# EAGLE design untitled (EAGLE 9.6.2)
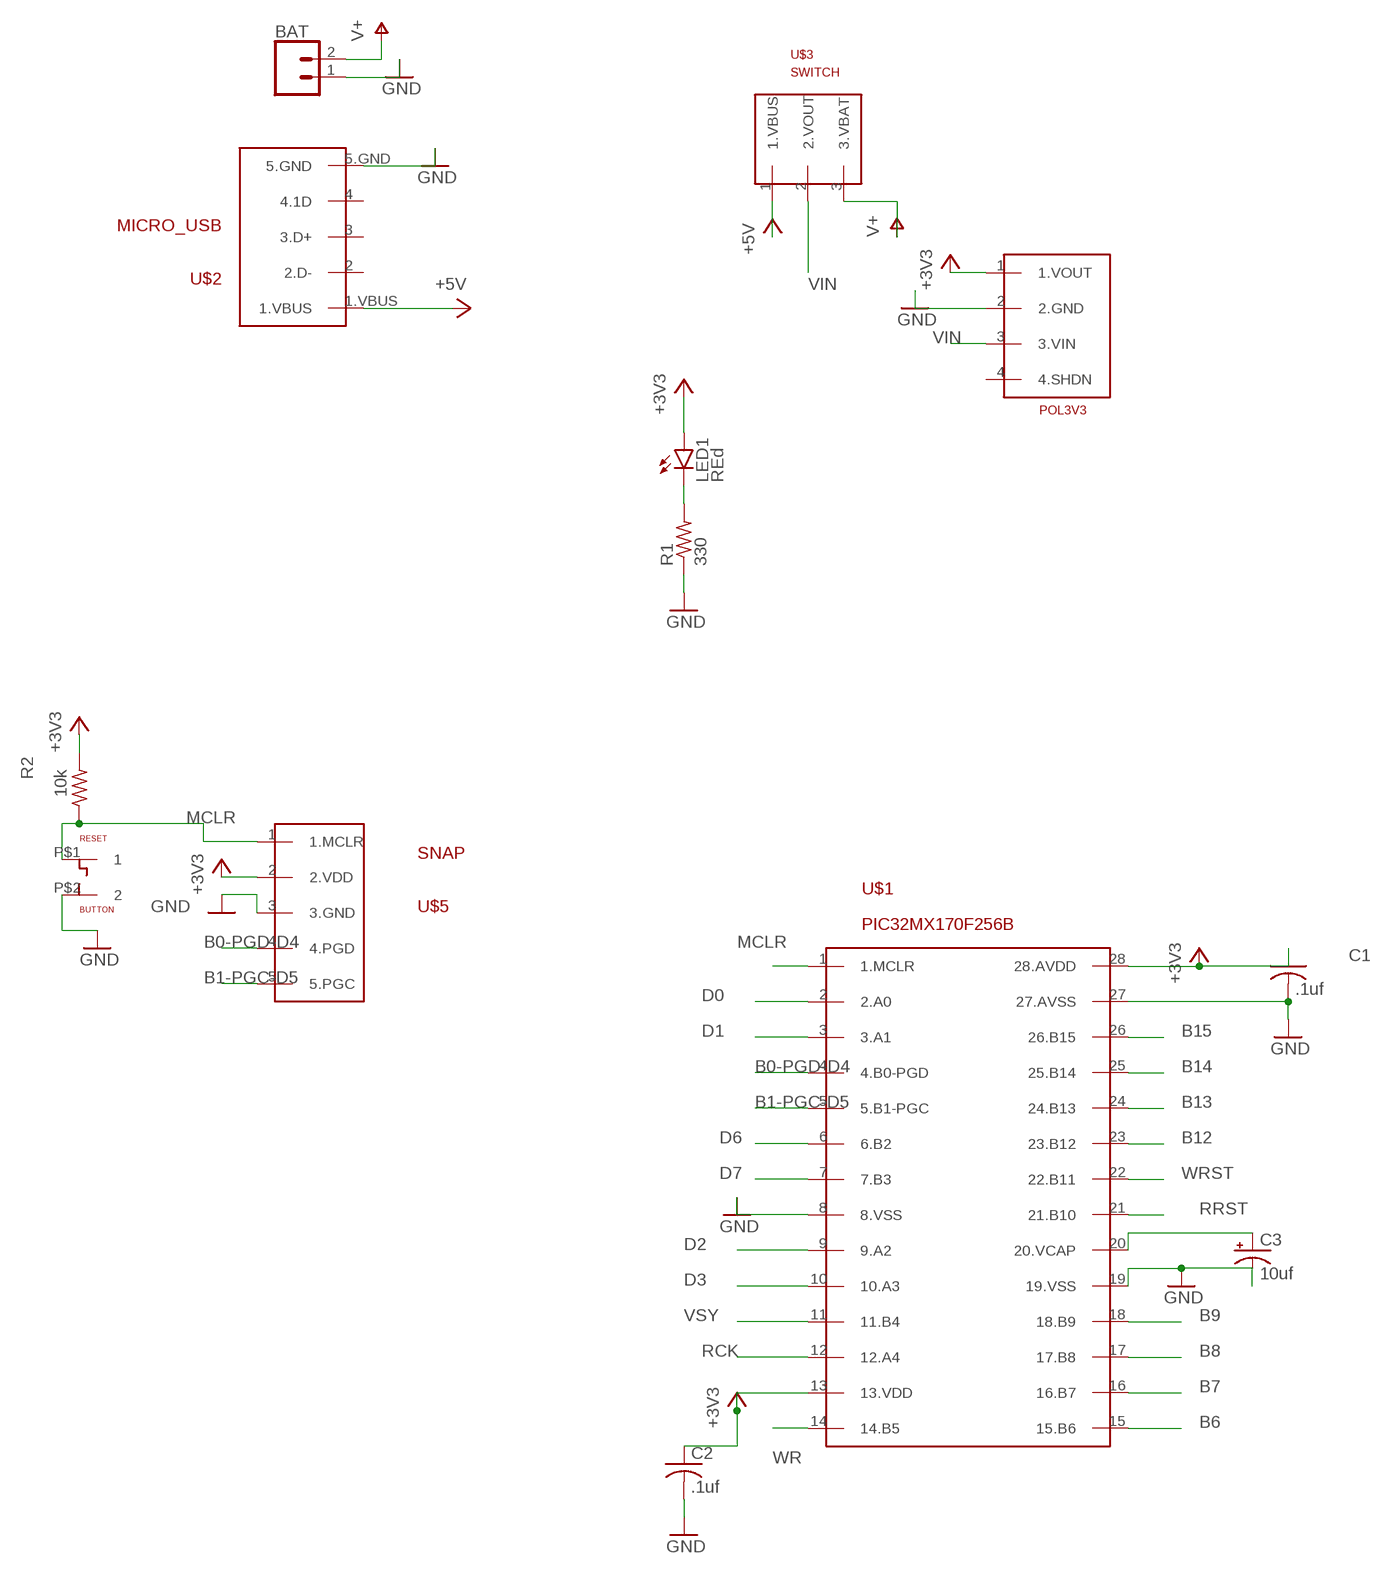
[diagram p0: schematic, sheet 1, part 1 of 2]
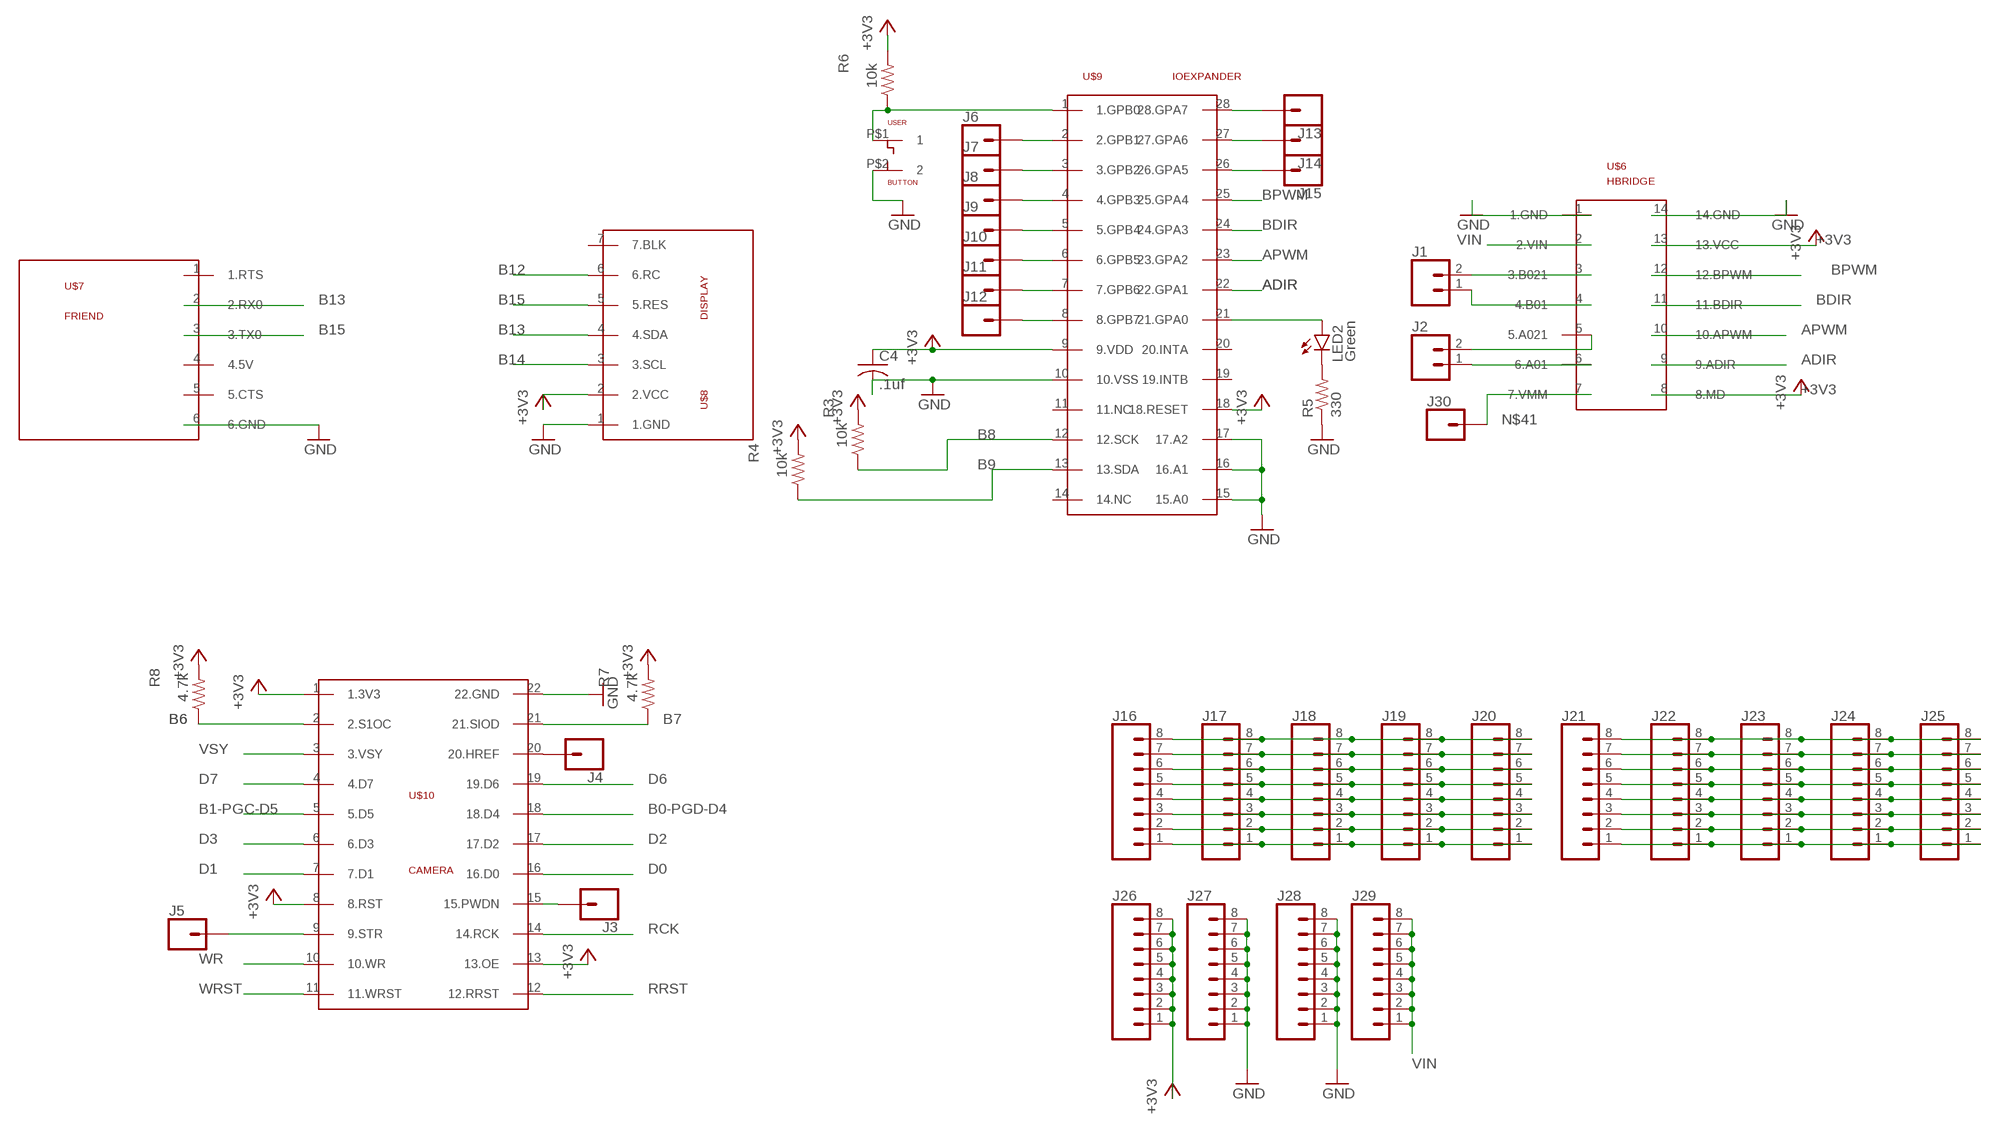
[diagram p1: schematic, sheet 1, part 2 of 2]

## Parts
BAT  CONN_02  [1X02]
C1  .1uf  C-US025-030X050  [C025-030X050]
C2  .1uf  C-US025-030X050  [C025-030X050]
C3  10uf  CPOL-USB45181B  [B45181B]
C4  .1uf  C-US025-030X050  [C025-030X050]
J1  CONN_02  [1X02]
J2  CONN_02  [1X02]
J3  CONN_01  [1X01]
J4  CONN_01  [1X01]
J5  CONN_01  [1X01]
J6  CONN_01  [1X01]
J7  CONN_01  [1X01]
J8  CONN_01  [1X01]
J9  CONN_01  [1X01]
J10  CONN_01  [1X01]
J11  CONN_01  [1X01]
J12  CONN_01  [1X01]
J13  CONN_01  [1X01]
J14  CONN_01  [1X01]
J15  CONN_01  [1X01]
J16  CONN_08"  [1X08]
J17  CONN_08"  [1X08]
J18  CONN_08"  [1X08]
J19  CONN_08"  [1X08]
J20  CONN_08"  [1X08]
J21  CONN_08"  [1X08]
J22  CONN_08"  [1X08]
J23  CONN_08"  [1X08]
J24  CONN_08"  [1X08]
J25  CONN_08"  [1X08]
J26  CONN_08"  [1X08]
J27  CONN_08"  [1X08]
J28  CONN_08"  [1X08]
J29  CONN_08"  [1X08]
J30  CONN_01  [1X01]
LED1  REd  LED3MM  [LED3MM]
LED2  Green  LED3MM  [LED3MM]
R1  330  R-US_0207/10  [0207/10]
R2  10k  R-US_0207/10  [0207/10]
R3  10k  R-US_0207/10  [0207/10]
R4  10k  R-US_0207/10  [0207/10]
R5  330  R-US_0207/10  [0207/10]
R6  10k  R-US_0207/10  [0207/10]
R7  4.7k  R-US_0207/10  [0207/10]
R8  4.7k  R-US_0207/10  [0207/10]
RESET  BUTTON  [BUTTON]
U$1  PIC32MX170F256B  [DIL28-3]
U$2  MICRO_USB  [MICRO_USB]
U$3  SWITCH  [SLIDE]
U$4  POL3V3  [POL3V3]
U$5  SNAP  [SNAP]
U$6  HBRIDGE  [HBRIDGE]
U$7  FRIEND  [FRIEND]
U$8  DISPLAY  [DISPLAY]
U$9  IOEXPANDER  [DIL28-3]
U$10  CAMERA  [CAMERA]
USER  BUTTON  [BUTTON]

## Nets
+3V3: C1.1 C2.1 C4.1 J26.1 J26.2 J26.3 J26.4 J26.5 J26.6 J26.7 J26.8 LED1.A R2.2 R3.2 R4.2 R6.2 R7.2 R8.2 U$1.13(13.VDD) U$1.28(28.AVDD) U$4.1(1.VOUT) U$5.2(2.VDD) U$6.8(8.MD) U$6.13(13.VCC) U$8.2(2.VCC) U$9.9(9.VDD) U$9.18(18.RESET) U$10.1(1.3V3) U$10.8(8.RST) U$10.13(13.OE)
+5V: U$2.1.VBUS U$3.1(1.VBUS)
ADIR: U$6.9(9.ADIR) U$9.22(22.GPA1)
APWM: U$6.10(10.APWM) U$9.23(23.GPA2)
B0-PGD-D4: U$1.4(4.B0-PGD) U$5.4(4.PGD) U$10.18(18.D4)
B1-PGC-D5: U$1.5(5.B1-PGC) U$5.5(5.PGC) U$10.5(5.D5)
B6: R8.1 U$1.15(15.B6) U$10.2(2.S1OC)
B7: R7.1 U$1.16(16.B7) U$10.21(21.SIOD)
B8: R3.1 U$1.17(17.B8) U$9.12(12.SCK)
B9: R4.1 U$1.18(18.B9) U$9.13(13.SDA)
B12: U$1.23(23.B12) U$8.6(6.RC)
B13: U$1.24(24.B13) U$7.2(2.RX0) U$8.4(4.SDA)
B14: U$1.25(25.B14) U$8.3(3.SCL)
B15: U$1.26(26.B15) U$7.3(3.TX0) U$8.5(5.RES)
BDIR: U$6.11(11.BDIR) U$9.24(24.GPA3)
BPWM: U$6.12(12.BPWM) U$9.25(25.GPA4)
D0: U$1.2(2.A0) U$10.16(16.D0)
D1: U$1.3(3.A1) U$10.7(7.D1)
D2: U$1.9(9.A2) U$10.17(17.D2)
D3: U$1.10(10.A3) U$10.6(6.D3)
D6: U$1.6(6.B2) U$10.19(19.D6)
D7: U$1.7(7.B3) U$10.4(4.D7)
GND: BAT.1 C1.2 C2.2 C3.- C4.2 J27.1 J27.2 J27.3 J27.4 J27.5 J27.6 J27.7 J27.8 J28.1 J28.2 J28.3 J28.4 J28.5 J28.6 J28.7 J28.8 R1.1 R5.1 RESET.P$2 U$1.8(8.VSS) U$1.19(19.VSS) U$1.27(27.AVSS) U$2.5.GND U$4.2(2.GND) U$5.3(3.GND) U$6.1(1.GND) U$6.14(14.GND) U$7.6(6.GND) U$8.1(1.GND) U$9.10(10.VSS) U$9.15(15.A0) U$9.16(16.A1) U$9.17(17.A2) U$10.22(22.GND) USER.P$2
MCLR: R2.1 RESET.P$1 U$1.1(1.MCLR) U$5.1(1.MCLR)
MCLR1: R6.1 U$9.1(1.GPB0) USER.P$1
N$1: LED1.K(C) R1.2
N$2: C3.+ U$1.20(20.VCAP)
N$3: LED2.A U$9.21(21.GPA0)
N$4: J16.8 J17.8 J18.8 J19.8 J20.8
N$5: LED2.K(C) R5.2
N$10: J13.1 U$9.28(28.GPA7)
N$11: J4.1 U$10.20(20.HREF)
N$12: J5.1 U$10.9(9.STR)
N$13: J3.1 U$10.15(15.PWDN)
N$14: J6.1 U$9.2(2.GPB1)
N$15: J7.1 U$9.3(3.GPB2)
N$16: J8.1 U$9.4(4.GPB3)
N$17: J9.1 U$9.5(5.GPB4)
N$18: J10.1 U$9.6(6.GPB5)
N$19: J11.1 U$9.7(7.GPB6)
N$20: J12.1 U$9.8(8.GPB7)
N$21: J14.1 U$9.27(27.GPA6)
N$22: J15.1 U$9.26(26.GPA5)
N$23: J16.7 J17.7 J18.7 J19.7 J20.7
N$24: J16.6 J17.6 J18.6 J19.6 J20.6
N$25: J16.5 J17.5 J18.5 J19.5 J20.5
N$26: J16.4 J17.4 J18.4 J19.4 J20.4
N$27: J16.3 J17.3 J18.3 J19.3 J20.3
N$28: J16.2 J17.2 J18.2 J19.2 J20.2
N$29: J16.1 J17.1 J18.1 J19.1 J20.1
N$30: J21.8 J22.8 J23.8 J24.8 J25.8
N$31: J21.7 J22.7 J23.7 J24.7 J25.7
N$32: J21.6 J22.6 J23.6 J24.6 J25.6
N$33: J21.5 J22.5 J23.5 J24.5 J25.5
N$34: J21.4 J22.4 J23.4 J24.4 J25.4
N$35: J21.3 J22.3 J23.3 J24.3 J25.3
N$36: J21.2 J22.2 J23.2 J24.2 J25.2
N$37: J21.1 J22.1 J23.1 J24.1 J25.1
N$41: J30.1 U$6.7(7.VMM)
N$42: J2.2 U$6.5(5.A021)
N$43: J2.1 U$6.6(6.A01)
N$44: J1.1 U$6.4(4.B01)
N$45: J1.2 U$6.3(3.B021)
RCK: U$1.12(12.A4) U$10.14(14.RCK)
RRST: U$1.21(21.B10) U$10.12(12.RRST)
V+: BAT.2 U$3.3(3.VBAT)
VIN: J29.1 J29.2 J29.3 J29.4 J29.5 J29.6 J29.7 J29.8 U$3.2(2.VOUT) U$4.3(3.VIN) U$6.2(2.VIN)
VSY: U$1.11(11.B4) U$10.3(3.VSY)
WR: U$1.14(14.B5) U$10.10(10.WR)
WRST: U$1.22(22.B11) U$10.11(11.WRST)
Unconnected: U$2.2(2.D-) U$2.3(3.D+) U$2.4(4.1D) U$4.4(4.SHDN) U$7.1(1.RTS) U$7.4(4.5V) U$7.5(5.CTS) U$8.7(7.BLK) U$9.11(11.NC) U$9.14(14.NC) U$9.19(19.INTB) U$9.20(20.INTA)

## Library data of the parts
BAT J1 J2 = pic_board_lib:CONN_02: Multi connection point. Often used as Generic Header-pin footprint for 0.1 inch spaced/style header connections On any of the 0.1 inch spaced packages, you can populate with these: Break Away Headers - Straight <https://www.sparkfun.com/products/116> (PRT-00116) Break Away Male Headers - Right Angle <https://www.sparkfun.com/products/553> (PRT-00553) Female Headers <https://www.sparkfun.com/products/115> (PRT-00115) Break Away Headers - Machine Pin <https://www.sparkfun.com/products/117> (PRT-00117) Break Away Female Headers - Swiss Machine Pin <https://www.sparkfun.com/products/743> (PRT-00743) For SCREWTERMINALS and SPRING TERMINALS visit here: Screw Terimnals on SparkFun.com <https://www.sparkfun.com/search/results?term=Screw+Terminals> (5mm/3.5mm/2.54mm spacing) This device is also useful as a general connection point to wire up your design to another part of your project. Our various solder wires solder well into these plated through hole pads. Hook-Up Wire - Assortment (Stranded, 22 AWG) <https://www.sparkfun.com/products/11375> (PRT-11375) Hook-Up Wire - Assortment (Solid Core, 22 AWG) <https://www.sparkfun.com/products/11367> (PRT-11367) View the entire wire category on our website here <https://www.sparkfun.com/categories/141> Special notes: Molex polarized connector foot print use with: PRT-08233 with associated crimp pins and housings. 2.54_SCREWTERM for use with PRT-10571. 3.5mm Screw Terminal footprints for PRT-08084 5mm Screw Terminal footprints for use with PRT-08432
C1 C2 C4 = pic_board_lib:C-US: CAPACITOR, American symbol; SPICEPREFIX: C
C3 = pic_board_lib:CPOL-US: POLARIZED CAPACITOR, American symbol; SPICEPREFIX: C
J3-J15 J30 = pic_board_lib:CONN_01: Single connection point. Often used as Generic Header-pin footprint for 0.1 inch spaced/style header connections On any of the 0.1 inch spaced packages, you can populate with these: Break Away Headers - Straight <https://www.sparkfun.com/products/116> (PRT-00116) Break Away Male Headers - Right Angle <https://www.sparkfun.com/products/553> (PRT-00553) Female Headers <https://www.sparkfun.com/products/115> (PRT-00115) Break Away Headers - Machine Pin <https://www.sparkfun.com/products/117> (PRT-00117) Break Away Female Headers - Swiss Machine Pin <https://www.sparkfun.com/products/743> (PRT-00743) This device is also useful as a general connection point to wire up your design to another part of your project. Our various solder wires solder well into these plated through hole pads. Hook-Up Wire - Assortment (Stranded, 22 AWG) <https://www.sparkfun.com/products/11375> (PRT-11375) Hook-Up Wire - Assortment (Solid Core, 22 AWG) <https://www.sparkfun.com/products/11367> (PRT-11367) View the entire wire category on our website here <https://www.sparkfun.com/categories/141> Special notes: SMTSO-256-ET is a "flush mount" nut for a 4-40 screw. We mostly use this on specialty testbeds; it is a nice way to connect hardware to your PCB at an adjustable hieght. Also note, the SNAP packages are for using a snappable style connector. We sell a baggie of snaps and they are also used on two LilyPad designs: Snap Assortment - 30 pack (male and female) <https://www.sparkfun.com/products/11347> (DEV-11347) LilyPad Arduino SimpleSnap <https://www.sparkfun.com/products/10941> (DEV-10941) LilyPad SimpleSnap Protoboard <https://www.sparkfun.com/products/10940> (DEV-10940)
J16-J29 = pic_board_lib:CONN_08: Multi connection point. Often used as Generic Header-pin footprint for 0.1 inch spaced/style header connections On any of the 0.1 inch spaced packages, you can populate with these: Break Away Headers - Straight <https://www.sparkfun.com/products/116> (PRT-00116) Break Away Male Headers - Right Angle <https://www.sparkfun.com/products/553> (PRT-00553) Female Headers <https://www.sparkfun.com/products/115> (PRT-00115) Break Away Headers - Machine Pin <https://www.sparkfun.com/products/117> (PRT-00117) Break Away Female Headers - Swiss Machine Pin <https://www.sparkfun.com/products/743> (PRT-00743) Arduino Stackable Header - 8 Pin <https://www.sparkfun.com/products/9279> (PRT-09279) For SCREWTERMINALS and SPRING TERMINALS visit here: Screw Terimnals on SparkFun.com <https://www.sparkfun.com/search/results?term=Screw+Terminals> (5mm/3.5mm/2.54mm spacing) This device is also useful as a general connection point to wire up your design to another part of your project. Our various solder wires solder well into these plated through hole pads. Hook-Up Wire - Assortment (Stranded, 22 AWG) <https://www.sparkfun.com/products/11375> (PRT-11375) Hook-Up Wire - Assortment (Solid Core, 22 AWG) <https://www.sparkfun.com/products/11367> (PRT-11367) View the entire wire category on our website here <https://www.sparkfun.com/categories/141> Special notes: Molex polarized connector foot print use with SKU : PRT-08231 with associated crimp pins and housings. 1MM SMD Version SKU: PRT-10208 NOTES ON THE VARIANTS LOCK and LOCK_LONGPADS... This footprint was designed to help hold the alignment of a through-hole component (i.e. 6-pin header) while soldering it into place. You may notice that each hole has been shifted either up or down by 0.005 of an inch from it's more standard position (which is a perfectly straight line). This slight alteration caused the pins (the squares in the middle) to touch the edges of the holes. Because they are alternating, it causes a "brace" to hold the component in place. 0.005 has proven to be the perfect amount of "off-center" position when using our standard breakaway headers. Although looks a little odd when you look at the bare footprint, once you have a header in there, the alteration is very hard to notice. Also,if you push a header all the way into place, it is covered up entirely on the bottom side.; PROD_ID: CONN-08438
LED1 LED2 = pic_board_lib:LED: LED OSRAM: - CHIPLED LG R971, LG N971, LY N971, LG Q971, LY Q971, LO R971, LY R971 LH N974, LH R974 LS Q976, LO Q976, LY Q976 LO Q996 - Hyper CHIPLED LW Q18S LB Q993, LB Q99A, LB R99A - SideLED LS A670, LO A670, LY A670, LG A670, LP A670 LB A673, LV A673, LT A673, LW A673 LH A674 LY A675 LS A676, LA A676, LO A676, LY A676, LW A676 LS A679, LY A679, LG A679 - Hyper Micro SIDELED® LS Y876, LA Y876, LO Y876, LY Y876 LT Y87S - SmartLED LW L88C, LW L88S LB L89C, LB L89S, LG L890 LS L89K, LO L89K, LY L89K LS L896, LA L896, LO L896, LY L896 - TOPLED LS T670, LO T670, LY T670, LG T670, LP T670 LSG T670, LSP T670, LSY T670, LOP T670, LYG T670 LG T671, LOG T671, LSG T671 LB T673, LV T673, LT T673, LW T673 LH T674 LS T676, LA T676, LO T676, LY T676, LB T676, LH T676, LSB T676, LW T676 LB T67C, LV T67C, LT T67C, LS T67K, LO T67K, LY T67K, LW E67C LS E67B, LA E67B, LO E67B, LY E67B, LB E67C, LV E67C, LT E67C LW T67C LS T679, LY T679, LG T679 LS T770, LO T770, LY T770, LG T770, LP T770 LB T773, LV T773, LT T773, LW T773 LH T774 LS E675, LA E675, LY E675, LS T675 LS T776, LA T776, LO T776, LY T776, LB T776 LHGB T686 LT T68C, LB T68C - Hyper Mini TOPLED® LB M676 - Mini TOPLED Santana® LG M470 LS M47K, LO M47K, LY M47K Source: http://www.osram.convergy.de LUXEON: - LUMILED® LXK2-PW12-R00, LXK2-PW12-S00, LXK2-PW14-U00, LXK2-PW14-V00 LXK2-PM12-R00, LXK2-PM12-S00, LXK2-PM14-U00 LXK2-PE12-Q00, LXK2-PE12-R00, LXK2-PE12-S00, LXK2-PE14-T00, LXK2-PE14-U00 LXK2-PB12-K00, LXK2-PB12-L00, LXK2-PB12-M00, LXK2-PB14-N00, LXK2-PB14-P00, LXK2-PB14-Q00 LXK2-PR12-L00, LXK2-PR12-M00, LXK2-PR14-Q00, LXK2-PR14-R00 LXK2-PD12-Q00, LXK2-PD12-R00, LXK2-PD12-S00 LXK2-PH12-R00, LXK2-PH12-S00 LXK2-PL12-P00, LXK2-PL12-Q00, LXK2-PL12-R00 Source: www.luxeon.com KINGBRIGHT: KA-3528ASYC Source: www.kingbright.com
R1-R8 = pic_board_lib:R-US_: RESISTOR, American symbol; SPICEPREFIX: R
RESET USER = pic_board_lib:BUTTON
U$1 = pic_board_lib:PIC32MX170F256B
U$2 = pic_board_lib:MICRO_USB
U$3 = pic_board_lib:SWITCH
U$4 = pic_board_lib:POL3V3
U$5 = pic_board_lib:SNAP
U$6 = pic_board_lib:HBRIDGE
U$7 = pic_board_lib:FRIEND
U$8 = pic_board_lib:DISPLAY
U$9 = pic_board_lib:IOEXPANDER
U$10 = pic_board_lib:CAMERA

## Board
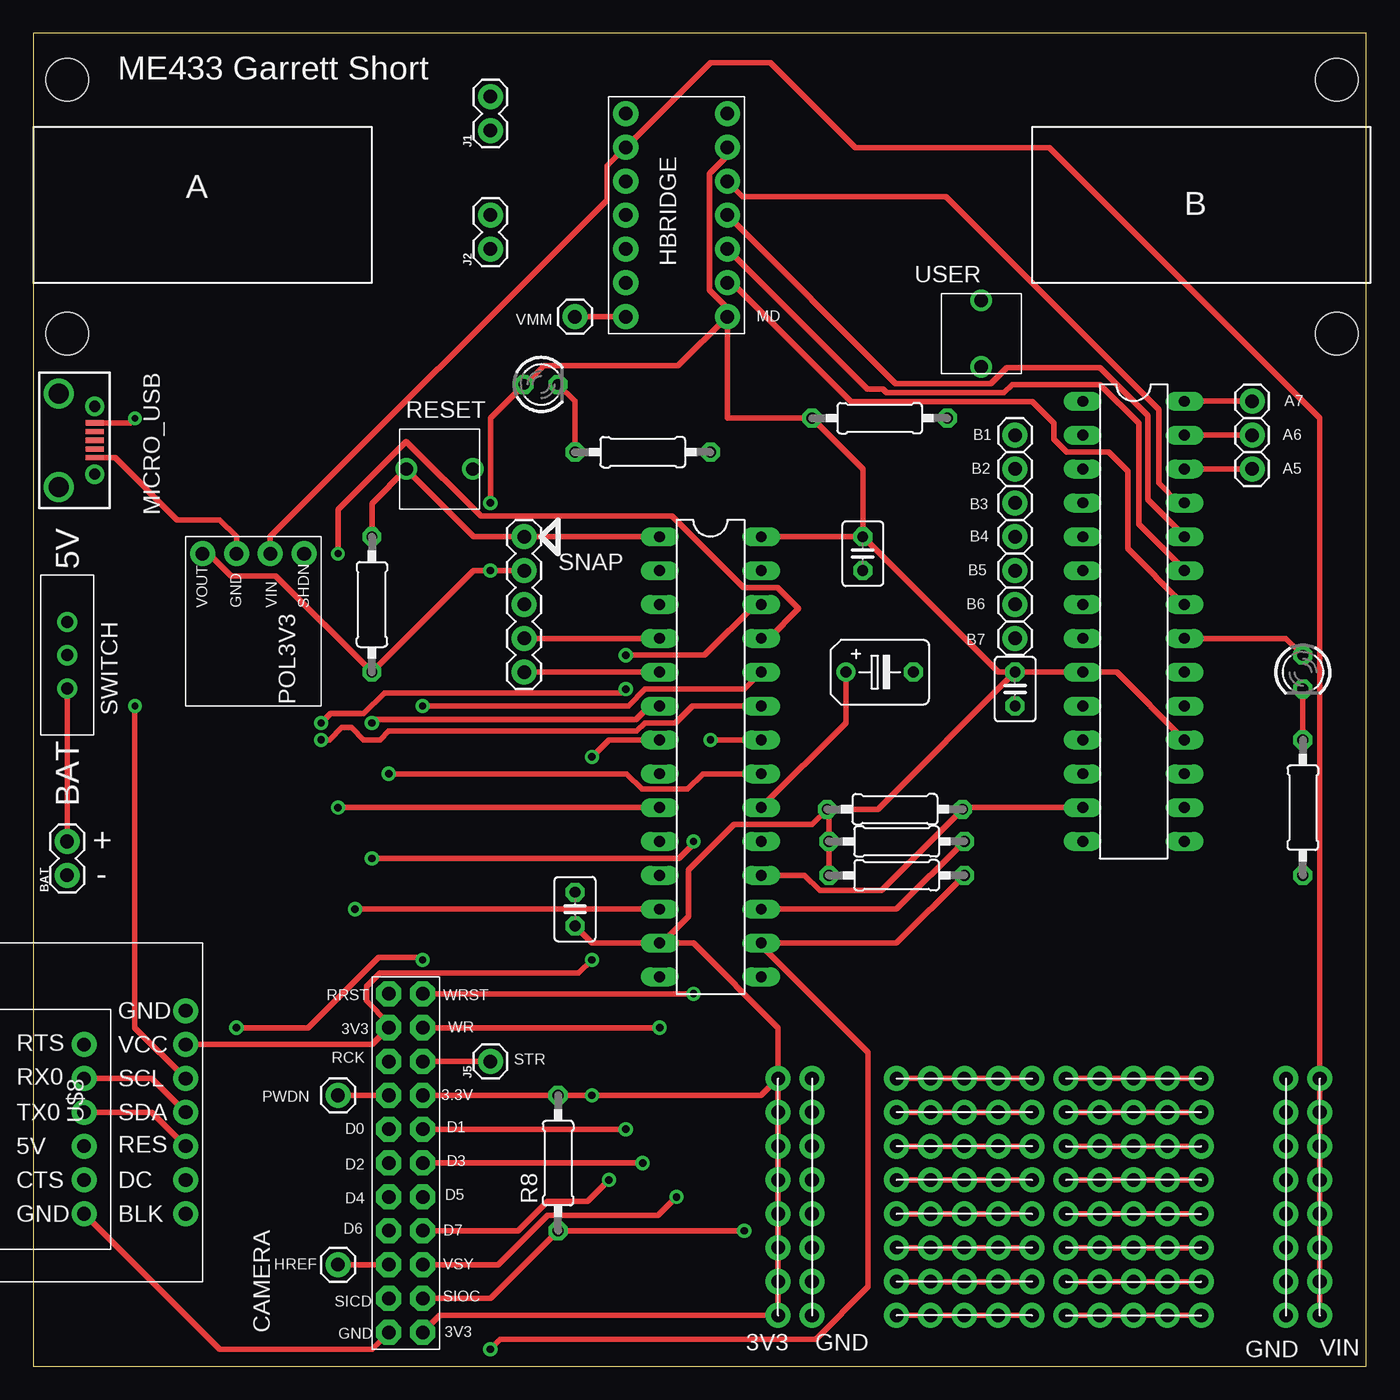
[diagram p2: board, top side]
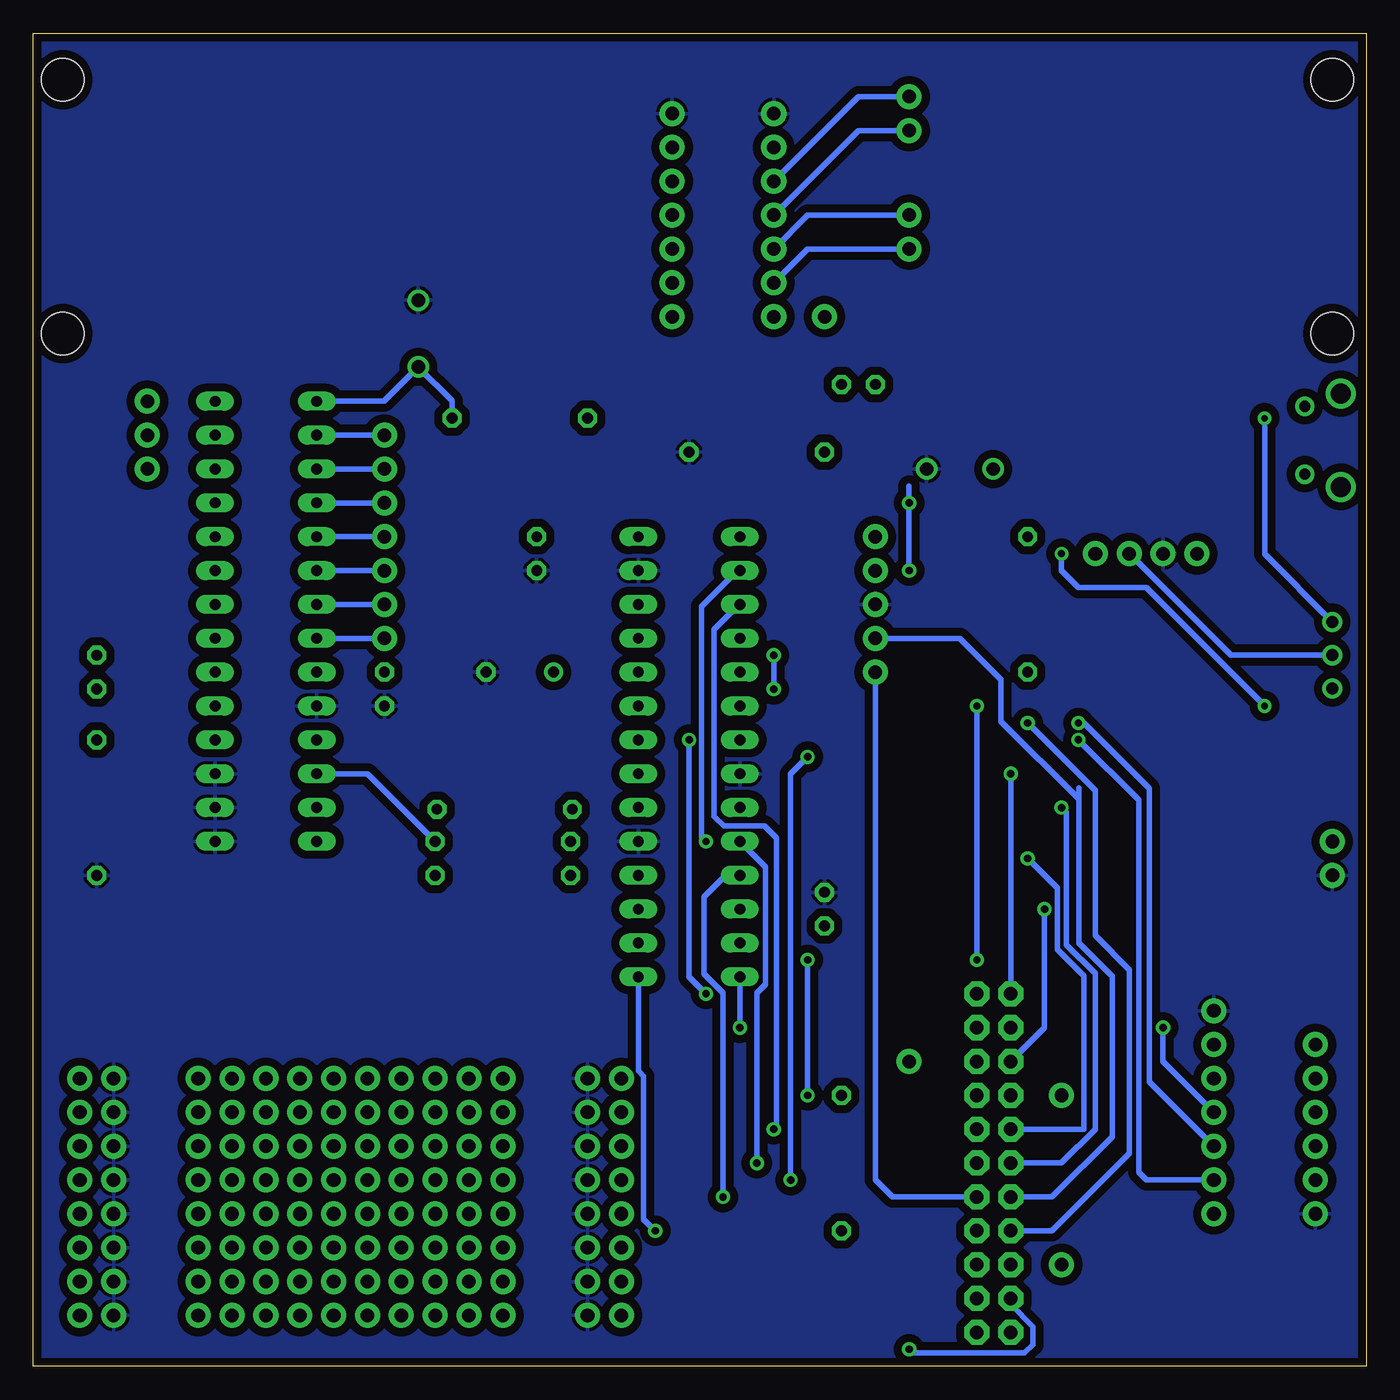
[diagram p3: board, bottom side, seen from below]

Size 100 x 100 mm. Coordinates in mm from the lower left corner, seen from the top.
Outline: 0,0 100,0 100,100 0,100 0,0
Copper layers (1*16): Top 0.035mm / dielectric 1.5mm / Bottom 0.035mm
Design rules "SparkFun": minimum track width 8mil, minimum drill 20mil, track to track 8mil, track to pad 8mil, pad to pad 8mil, via to via 8mil, smd to smd 8mil, copper to edge 8mil, drill to drill 8mil, minimum pad ring 12mil, minimum via ring 10mil, stop-mask expansion 4mil, vias tented up to drill 20mil, thermal gap 10mil
Holes 3.17 mm at 2.54,96.52 2.54,77.47 97.79,77.47 97.79,96.52

### Footprints (pad centres in the part's own frame; a part is rotated, then mirrored left to right if it is on the bottom)
1X02 = drill 1.016 pad 1.88: 1 0,0; 2 2.54,0
C025-030X050 = drill 0.813 octagon: 1 -1.27,0; 2 1.27,0
B45181B = drill 0.813: + -2.54,0 | drill 0.813 octagon: - 2.54,0
1X01 = drill 1.016 pad 1.88: 1 0,0
1X08 = drill 1.016 pad 1.88: 1 0,0; 2 2.54,0; 3 5.08,0; 4 7.62,0; 5 10.16,0; 6 12.7,0; 7 15.24,0; 8 17.78,0
LED3MM = drill 0.813 octagon: A -1.27,0; K 1.27,0
0207/10 = drill 0.813 octagon: 1 -5.08,0; 2 5.08,0
BUTTON = drill 1: P$1 -2.5,0; P$2 2.5,0
DIL28-3 = drill 0.813 long: 1 -16.51,-3.81; 2 -13.97,-3.81; 3 -11.43,-3.81; 4 -8.89,-3.81; 5 -6.35,-3.81; 6 -3.81,-3.81; 7 -1.27,-3.81; 8 1.27,-3.81; 9 3.81,-3.81; 10 6.35,-3.81; 11 8.89,-3.81; 12 11.43,-3.81; 13 13.97,-3.81; 14 16.51,-3.81; 15 16.51,3.81; 16 13.97,3.81; 17 11.43,3.81; 18 8.89,3.81; 19 6.35,3.81; 20 3.81,3.81; 21 1.27,3.81; 22 -1.27,3.81; 23 -3.81,3.81; 24 -6.35,3.81; 25 -8.89,3.81; 26 -11.43,3.81; 27 -13.97,3.81; 28 -16.51,3.81
MICRO_USB = smd 0.4 x 1.35: 1.VBUS -1.3,2.7; 2 -0.65,2.7; 3 0,2.7; 4 0.66,2.7; 5.GND 1.3,2.7 | drill 0.85: P$6 -2.54,2.7; P$7 2.54,2.7 | drill 1.5: P$8 -3.5,0; P$9 3.5,0
SLIDE = drill 0.9: 1 -2.5,0; 2 0,0; 3 2.5,0
POL3V3 = drill 1.016 pad 1.88: 1 0,3.81; 2 0,1.27; 3 0,-1.27; 4 0,-3.81
SNAP = drill 1.016 pad 1.88: 1 0,5.08; 2 0,2.54; 3 0,0; 4 0,-2.54; 5 0,-5.08
HBRIDGE = drill 1.016 pad 1.88: 1 -3.81,7.62; 2 -3.81,5.08; 3 -3.81,2.54; 4 -3.81,0; 5 -3.81,-2.54; 6 -3.81,-5.08; 7 -3.81,-7.62; 8 3.81,-7.62; 9 3.81,-5.08; 10 3.81,-2.54; 11 3.81,0; 12 3.81,2.54; 13 3.81,5.08; 14 3.81,7.62
FRIEND = drill 1.016 pad 1.88: 1 0,6.35; 2 0,3.81; 3 0,1.27; 4 0,-1.27; 5 0,-3.81; 6 0,-6.35
DISPLAY = drill 1.016 pad 1.88: 1 -7.62,0; 2 -5.08,0; 3 -2.54,0; 4 0,0; 5 2.54,0; 6 5.08,0; 7 7.62,0
CAMERA = drill 1.016 pad 1.88 octagon: 1 -12.7,-1.27; 2 -10.16,-1.27; 3 -7.62,-1.27; 4 -5.08,-1.27; 5 -2.54,-1.27; 6 0,-1.27; 7 2.54,-1.27; 8 5.08,-1.27; 9 7.62,-1.27; 10 10.16,-1.27; 11 12.7,-1.27; 12 12.7,1.27; 13 10.16,1.27; 14 7.62,1.27; 15 5.08,1.27; 16 2.54,1.27; 17 0,1.27; 18 -2.54,1.27; 19 -5.08,1.27; 20 -7.62,1.27; 21 -10.16,1.27; 22 -12.7,1.27

### Placement (x,y rotation side)
BAT  2.54,36.83 90 top
C1  62.23,60.96 270 top
C2  40.64,34.29 90 top
C3  63.5,52.07 0 top
C4  73.66,50.8 270 top
J1  34.29,92.71 90 top
J2  34.29,83.82 90 top
J3  22.86,20.32 90 top
J4  22.86,7.62 90 top
J5  34.29,22.86 90 top
J6  73.66,69.85 90 top
J7  73.66,67.31 90 top
J8  73.66,64.77 90 top
J9  73.66,62.23 90 top
J10  73.66,59.69 90 top
J11  73.66,57.15 90 top
J12  73.66,54.61 90 top
J13  91.44,72.39 90 top
J14  91.44,69.85 90 top
J15  91.44,67.31 90 top
J16  74.93,3.81 90 top
J17  67.31,3.81 90 top
J18  64.77,3.81 90 top
J19  69.85,3.81 90 top
J20  72.39,3.81 90 top
J21  77.47,3.81 90 top
J22  80.01,3.81 90 top
J23  82.55,3.81 90 top
J24  85.09,3.81 90 top
J25  87.63,3.81 90 top
J26  55.88,3.81 90 top
J27  58.42,3.81 90 top
J28  93.98,3.81 90 top
J29  96.52,3.81 90 top
J30  40.64,78.74 0 top
LED1  38.1,73.66 0 top
LED2  95.25,52.07 270 top
R1  45.72,68.58 180 top
R2  25.4,57.15 270 top
R3  64.77,39.37 180 top
R4  64.64,41.78 180 top
R5  95.25,41.91 90 top
R6  63.5,71.12 180 top
R7  64.77,36.83 180 top
R8  39.37,15.24 90 top
RESET  30.48,67.31 0 top
U$1  50.8,45.72 270 top
U$2  1.91,69.47 270 top
U$3  2.54,53.34 270 top
U$4  16.51,60.96 90 top
U$5  36.83,57.15 0 top
U$6  48.26,86.36 0 top
U$7  3.81,17.78 0 top
U$8  11.43,19.05 270 top
U$9  82.55,55.88 270 top
U$10  27.94,15.24 90 top
USER  71.12,77.47 90 top

### Tracks (layer width: path | path; a pad name or v marks a point on that pad's centre or on a via)
+3V3  (via drill 0.55)
  Top 0.406: U$4.1 13.15,60.96 14.83,59.28 18.19,59.28 R2.2 33.02,59.69 v34.29,59.69 U$5.2 | C1.1 62.23,67.31 R6.2 52.07,71.12 U$6.8 | C1.1 U$1.28 | C1.1 72.39,52.07 C4.1 | C4.1 63.37,41.78 R4.2 | C4.1 U$9.9 81.28,52.07 U$9.18 | R4.2 58.42,40.64 52.58,40.64 49.17,37.24 49.17,33.74 47.18,31.75 U$1.13 | U$1.13 49.53,31.75 55.88,25.4 J26.8 | U$1.13 41.91,31.75 C2.1 | J26.8 54.61,20.32 v41.91,20.32 R8.2 U$10.8 | R4.2 59.69,41.66 R3.2 R7.2 | v34.29,64.77 34.29,71.12 LED1.A 36.92,73.66 38.31,75.06 48.39,75.06 U$6.8 | J26.8 J26.7 J26.6 J26.5 J26.4 J26.3 J26.2 J26.1 30.48,3.81 U$10.1 | U$8.2 25.4,24.13 U$10.13 26.67,25.73 24.99,27.4 24.99,28.48 26.01,29.49 40.92,29.49 v41.91,30.48 | U$6.8 52.07,79.38 50.72,80.72 50.72,89.46 52.07,90.8 U$6.13
  Bottom 0.406: v34.29,59.69 v34.29,64.77 34.29,66.04 | v41.91,20.32 v41.91,30.48
+5V  (via drill 0.51)
  Top 0.406: U$2.1.VBUS 7.27,70.77 v7.62,71.12
  Bottom 0.406: U$3.1 7.62,60.92 v7.62,71.12
ADIR
  Top 0.406: U$9.22 86.3,57.15 82.12,61.33 82.12,67.17 80.71,68.58 77.53,68.58 76.56,69.56 76.56,70.76 74.96,72.36 61.34,72.36 52.42,81.28 U$6.9
APWM
  Top 0.406: U$9.23 86.36,59.75 82.93,63.18 82.93,70.74 80.01,73.66 73.44,73.66 72.83,73.05 64.01,73.05 63.75,73.3 62.59,73.3 U$6.10
B0-PGD-D4
  Top 0.406: U$5.4 U$1.4
  Bottom 0.406: U$10.18 23.57,12.7 19.05,17.22 19.05,29.23 21.57,31.75 21.57,42.55 | 21.57,42.55 21.57,43.39 | U$5.4 30.48,54.61 27.4,51.53 27.4,48.38 21.57,42.55
B1-PGC-D5
  Top 0.406: U$1.5 U$5.5
  Bottom 0.406: U$5.5 36.83,13.97 35.56,12.7 U$10.5
B6  (via drill 0.55)
  Top 0.406: v53.34,10.16 R8.1 34.29,5.08 U$10.2
  Bottom 0.406: U$1.15 54.61,22.15 54.2,21.75 54.2,11.02 v53.34,10.16
B7  (via drill 0.55)
  Top 0.406: R7.1 64.77,31.75 U$1.16 54.61,31.56 62.64,23.54 62.64,5.94 58.7,2.01 35.03,2.01 v34.29,1.27
  Bottom 0.406: U$10.21 26.67,4.63 24.99,2.95 24.99,1.62 25.62,0.99 34.01,0.99 v34.29,1.27
B8
  Top 0.406: U$1.17 64.77,34.29 R3.1
  Bottom 0.406: R3.1 74.93,44.45 U$9.12
B9
  Top 0.406: U$1.18 57.87,36.83 59.02,35.69 63.63,35.69 R4.1 69.85,41.91 U$9.13
B12  (via drill 0.55 pad 0.55)
  Top 0.406: U$1.23 49.47,49.53 48.2,48.26 45.88,48.26 45.27,47.65 26.67,47.65 26.01,46.99 24.79,46.99 23.88,47.91 23.14,47.91 22.23,46.99 v21.59,46.99
  Bottom 0.406: U$8.6 16.51,13.97 17.07,14.53 17.07,42.47 v21.59,46.99
B13  (via drill 0.55)
  Top 0.406: U$7.2 8.89,21.59 U$8.4 | v29.21,49.53 44.64,49.53 45.91,50.8 53.34,50.8 U$1.24 | v29.21,30.48 29.01,30.68 25.9,30.68 20.62,25.4 v15.24,25.4
  Bottom 0.406: v29.21,49.53 v29.21,30.48 | v15.24,25.4 15.24,22.86 U$8.4
B14  (via drill 0.51)
  Top 0.406: U$1.25 55.18,54.61 57.41,56.83 55.82,58.42 53.28,58.42 47.92,63.78 33.59,63.78 27.98,69.39 22.86,64.27 v22.86,60.96 | v7.62,49.53 7.62,25.4 U$8.3
  Bottom 0.406: v7.62,49.53 16.51,58.42 21.59,58.42 22.86,59.69 v22.86,60.96
B15  (via drill 0.55, 0.55 pad 0.55)
  Top 0.406: U$7.3 8.89,19.05 U$8.5 | v21.59,48.26 22.3,48.97 24.79,48.97 26.34,50.52 44.17,50.52 v44.45,50.8 | U$1.26 54.17,57.15 50.36,53.34 v44.45,53.34
  Bottom 0.406: U$8.5 16.26,21.34 16.26,43.33 21.19,48.26 v21.59,48.26 | v44.45,53.34 v44.45,50.8
BDIR
  Top 0.406: U$9.24 86.36,62.29 83.62,65.03 83.62,71.32 80.01,74.93 73.03,74.93 71.83,73.73 64.7,73.73 U$6.11
BPWM
  Top 0.406: U$9.25 85.91,64.77 84.43,66.25 84.43,71.78 68.45,87.76 53.21,87.76 U$6.12
D0  (via drill 0.55)
  Top 0.406: v25.4,38.1 48.45,38.1 49.53,39.18 v49.53,39.37
  Bottom 0.406: U$10.16 21.18,17.78 21.18,29.28 23.16,31.27 23.16,35.87 v25.4,38.1 | U$1.2 47.18,59.69 49.86,57.01 49.86,39.7 v49.53,39.37
D1  (via drill 0.55)
  Top 0.406: v44.45,17.78 U$10.7
  Bottom 0.406: U$1.3 47.05,57.15 48.92,55.28 48.92,41.23 48.2,40.51 45.15,40.51 44.25,39.61 44.25,17.98 v44.45,17.78
D2  (via drill 0.55)
  Top 0.406: v22.86,41.91 U$1.9
  Bottom 0.406: U$10.17 22.86,15.24 20.32,17.78 20.32,29.46 22.48,31.62 22.48,41.53 v22.86,41.91
D3  (via drill 0.55)
  Top 0.406: U$10.6 v45.72,15.24
  Bottom 0.406: v45.72,15.24 45.72,28 45.06,28.66 45.06,37.44 U$1.10
D6  (via drill 0.55 pad 0.55)
  Top 0.406: v25.4,48.26 25.65,48.51 45.21,48.51 46.23,49.53 U$1.6
  Bottom 0.406: v25.4,48.26 20.32,43.18 20.32,32.31 17.75,29.75 17.75,15.97 23.57,10.16 U$10.19
D7  (via drill 0.55)
  Top 0.406: v43.18,13.97 41.58,12.37 38.59,12.37 36.38,10.16 U$10.4 | v41.91,45.72 43.18,46.99 U$1.7
  Bottom 0.406: v41.91,45.72 43.18,44.45 v43.18,13.97
GND
  Top 0.406: U$2.5.GND 6.13,68.17 10.8,63.5 13.97,63.5 15.24,62.23 U$4.2 | U$10.22 25.4,1.27 13.97,1.27 U$7.6
  pour Bottom (isolate 0.61): 0,0 100.33,0 100.33,100.33 0,100.33
MCLR
  Top 0.406: R2.1 25.4,64.73 27.96,67.29 | 27.96,67.29 RESET.P$1 | 27.96,67.29 33.02,62.23 U$5.1 U$1.1
MCLR1
  Bottom 0.406: R6.1 68.58,72.43 USER.P$1 73.7,72.39 U$9.1
N$1
  Top 0.406: LED1.K 40.64,72.39 R1.2
N$2
  Top 0.406: U$1.20 60.96,48.26 C3.+
N$3
  Top 0.406: U$9.21 93.98,54.61 LED2.A
N$4
  Top 0.406: J18.8 J17.8 J19.8 J20.8 J16.8
N$5
  Top 0.406: LED2.K R5.2
N$10
  Top 0.406: U$9.28 J13.1
N$11
  Top 0.406: U$10.20 J4.1
N$12
  Top 0.406: U$10.9 J5.1
N$13
  Top 0.406: U$10.15 J3.1
N$14
  Bottom 0.406: U$9.2 J6.1
N$15
  Bottom 0.406: U$9.3 J7.1
N$16
  Bottom 0.406: U$9.4 J8.1
N$17
  Bottom 0.406: U$9.5 J9.1
N$18
  Bottom 0.406: U$9.6 J10.1
N$19
  Bottom 0.406: U$9.7 J11.1
N$20
  Bottom 0.406: U$9.8 J12.1
N$21
  Top 0.406: U$9.27 J14.1
N$22
  Top 0.406: U$9.26 J15.1
N$23
  Top 0.406: J16.7 J20.7 J19.7 J17.7 J18.7
N$24
  Top 0.406: J18.6 J17.6 J19.6 J20.6 J16.6
N$25
  Top 0.406: J16.5 J20.5 J19.5 J17.5 J18.5
N$26
  Top 0.406: J18.4 J17.4 J19.4 J20.4 J16.4
N$27
  Top 0.406: J16.3 J20.3 J19.3 J17.3 J18.3
N$28
  Top 0.406: J18.2 J17.2 J19.2 J20.2 J16.2
N$29
  Top 0.406: J16.1 J20.1 J19.1 J17.1 J18.1
N$30
  Top 0.406: J21.8 J22.8 J23.8 J24.8 J25.8
N$31
  Top 0.406: J25.7 J24.7 J23.7 J22.7 J21.7
N$32
  Top 0.406: J21.6 J22.6 J23.6 J24.6 J25.6
N$33
  Top 0.406: J25.5 J24.5 J23.5 J22.5 J21.5
N$34
  Top 0.406: J21.4 J22.4 J23.4 J24.4 J25.4
N$35
  Top 0.406: J25.3 J24.3 J23.3 J22.3 J21.3
N$36
  Top 0.406: J21.2 J22.2 J23.2 J24.2 J25.2
N$37
  Top 0.406: J21.1 J22.1 J23.1 J24.1 J25.1
N$41
  Top 0.406: U$6.7 J30.1
N$42
  Bottom 0.406: J2.2 41.91,86.36 U$6.5
N$43
  Bottom 0.406: J2.1 41.91,83.82 U$6.6
N$44
  Bottom 0.406: J1.1 38.1,92.71 U$6.4
N$45
  Bottom 0.406: J1.2 38.1,95.25 U$6.3
RCK  (via drill 0.55)
  Top 0.406: v24.13,34.29 U$1.12
  Bottom 0.406: U$10.14 24.13,25.4 v24.13,34.29
RRST  (via drill 0.55)
  Top 0.406: U$1.21 50.23,44.45 49.09,43.31 45.66,43.31 44.51,44.45 v26.67,44.45
  Bottom 0.406: U$10.12 v26.67,44.45
V+
  Top 0.406: BAT.2 U$3.3
VIN
  Top 0.406: U$4.3 17.78,62.23 43.03,87.48 43.03,90.07 44.4,91.44 U$6.2 50.8,97.79 55.32,97.79 61.69,91.42 76.22,91.42 96.52,71.12 J29.8 J29.7 J29.6 J29.5 J29.4 J29.3 J29.2 J29.1
  Bottom 0.406: U$4.3 10.16,53.34 U$3.2
VSY  (via drill 0.55)
  Top 0.406: v48.26,12.7 46.86,11.3 38.57,11.3 34.88,7.62 U$10.3
  Bottom 0.406: U$1.11 48.07,36.83 49.68,35.22 49.68,29.42 48.26,28 v48.26,12.7
WR  (via drill 0.55)
  Top 0.406: U$10.10 v46.99,25.4
  Bottom 0.406: v46.99,25.4 U$1.14
WRST  (via drill 0.55)
  Top 0.406: U$10.11 v49.53,27.94 | v50.8,46.99 U$1.22
  Bottom 0.406: v50.8,46.99 50.8,29.21 v49.53,27.94

### Text on the board
tPlace: ME433 Garrett Short | A | B | VMM | MD | A7 | B1 | A6 | B2 | A5 | B3 | B4 | 5V | B5 | B6 | B7 | BAT | + | - | RRST | WRST | 3V3 | WR | RCK | STR | PWDN | 3.3V | D1 | D0 | D2 | D3 | D4 | D5 | D6 | D7 | HREF | VSY | SIOC | SICD | GND | 3V3 | 3V3 | GND | GND | VIN